# EAGLE design SparkFun_Si4707_Breakout (EAGLE 7.2.0)
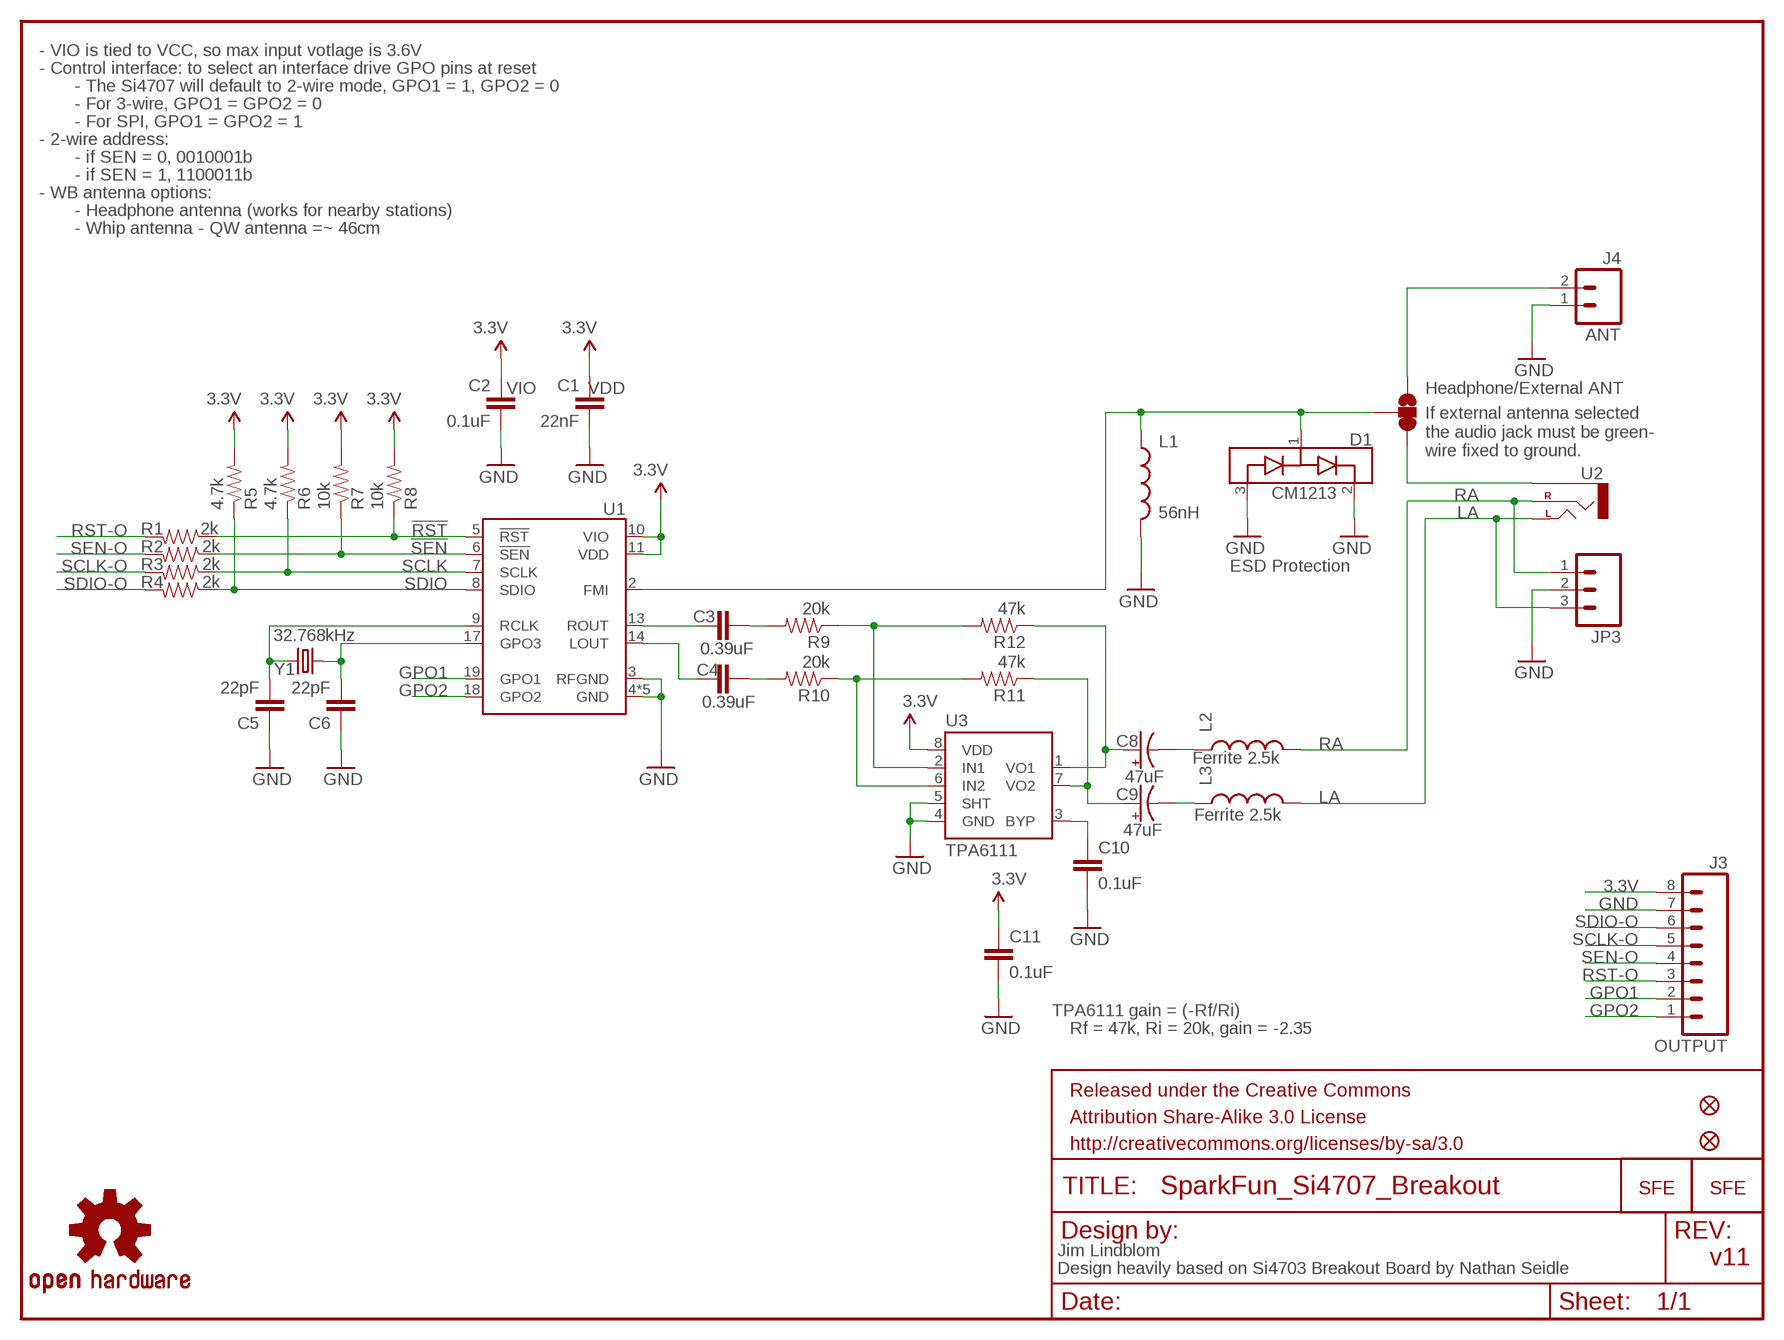
[diagram p0: schematic, sheet 1]

## Parts
C1  22nF  CAP0402-CAP  [0402-CAP]
C2  0.1uF  CAP0402-CAP  [0402-CAP]
C3  0.39uF  CAP0402-CAP  [0402-CAP]
C4  0.39uF  CAP0402-CAP  [0402-CAP]
C5  22pF  CAP0402-CAP  [0402-CAP]
C6  22pF  CAP0402-CAP  [0402-CAP]
C8  47uF  CAP_POL3528  [EIA3528]
C9  47uF  CAP_POL3528  [EIA3528]
C10  0.1uF  CAP0402-CAP  [0402-CAP]
C11  0.1uF  CAP0402-CAP  [0402-CAP]
D1  CM1213  [SOT23-3]
FRAME1  FRAME-LETTER  [CREATIVE_COMMONS]
J3  OUTPUT  M081X08  [1X08]
J4  ANT  M02PTH  [1X02]
JP1  LOGO-SFENEW  [SFE-NEW-WEBLOGO]
JP2  LOGO-SFESK  [SFE-LOGO-FLAME]
JP3  M03PTH  [1X03]
JP4  FIDUCIALUFIDUCIAL  [MICRO-FIDUCIAL]
JP5  FIDUCIALUFIDUCIAL  [MICRO-FIDUCIAL]
L1  56nH  INDUCTOR0603  [0603]
L2  Ferrite 2.5k  INDUCTOR0402  [C0402]
L3  Ferrite 2.5k  INDUCTOR0402  [C0402]
R1  2k  RESISTOR0402-RES  [0402-RES]
R2  2k  RESISTOR0402-RES  [0402-RES]
R3  2k  RESISTOR0402-RES  [0402-RES]
R4  2k  RESISTOR0402-RES  [0402-RES]
R5  4.7k  RESISTOR0402-RES  [0402-RES]
R6  4.7k  RESISTOR0402-RES  [0402-RES]
R7  10k  RESISTOR0402-RES  [0402-RES]
R8  10k  RESISTOR0402-RES  [0402-RES]
R9  20k  RESISTOR0402-RES  [0402-RES]
R10  20k  RESISTOR0402-RES  [0402-RES]
R11  47k  RESISTOR0402-RES  [0402-RES]
R12  47k  RESISTOR0402-RES  [0402-RES]
SJ2  SOLDERJUMPER_2WAYS  [SJ_3]
U1  SI4707  [SI470X]
U2  AUDIO-JACKSMD2  [AUDIO-JACK-3.5MM-SMD]
U3  TPA6111  SPARKFUN_TPA6111SMD  [SPARKFUN_SO08]
U$2  OSHW-LOGOS  [OSHW-LOGO-S]
Y1  32.768kHz  CRYSTAL32-SMD  [CRYSTAL-32KHZ-SMD]

## Nets
3.3V: C1.1 C2.1 C11.1 J3.8 R5.2 R6.2 R7.2 R8.2 U1.10(VIO) U1.11(VDD) U3.8(VDD)
!RST: R1.1 R8.1 U1.5(!RST)
!SEN: R2.1 R7.1 U1.6(!SEN)
GND: C1.2 C2.2 C5.1 C6.1 C10.2 C11.2 D1.2(VP) D1.3(VN) J3.7 J4.1 JP3.2 L1.2 U1.3(RFGND) U1.4(GND) U1.12(GND) U1.15(GND) U1.16(GND) U1.21(GND) U3.4(GND) U3.5(SHT)
GPO1: J3.2 U1.19(GPO1)
GPO2: J3.1 U1.18(GPO2)
J1: D1.1(CH1) L1.1 SJ2.2 U1.2(FMI)
LA: JP3.3 L3.2 U2.TIP(LEFT)
LOUT: C4.1 U1.14(LOUT)
N$3: C3.2 R9.2
N$4: C4.2 R10.2
N$6: C6.2 U1.17(GPO3) Y1.X1
N$7: SJ2.1 U2.SLEEVE
N$9: J4.2 SJ2.3
N$10: R9.1 R12.2 U3.2(IN1)
N$11: R10.1 R11.2 U3.6(IN2)
N$12: C10.1 U3.3(BYP)
N$13: C8.C(-) L2.1
N$14: C9.C(-) L3.1
N$15: C8.A(+) R12.1 U3.1(VO1)
N$16: C9.A(+) R11.1 U3.7(VO2)
RA: JP3.1 L2.2 U2.RING(RIGHT)
RCLK: C5.2 U1.9(RCLK) Y1.X2
ROUT: C3.1 U1.13(ROUT)
RST-O: J3.3 R1.2
SCLK: R3.1 R6.1 U1.7(SCLK)
SCLK-O: J3.5 R3.2
SDIO: R4.1 R5.1 U1.8(SDIO)
SDIO-O: J3.6 R4.2
SEN-O: J3.4 R2.2

## Notes on the sheet
- - VIO is tied to VCC, so max input votlage is 3.6V
- - Control interface: to select an interface drive GPO pins at reset
- - The Si4707 will default to 2-wire mode, GPO1 = 1, GPO2 = 0
- - For 3-wire, GPO1 = GPO2 = 0
- - For SPI, GPO1 = GPO2 = 1
- - 2-wire address:
- - if SEN = 0, 0010001b
- - if SEN = 1, 1100011b
- - WB antenna options:
- - Headphone antenna (works for nearby stations)
- - Whip antenna - QW antenna =~ 46cm
- VIO | VDD | Headphone/External ANT
- If external antenna selected
  the audio jack must be green-
  wire fixed to ground.
- ESD Protection
- TPA6111 gain = (-Rf/Ri)
- Rf = 47k, Ri = 20k, gain = -2.35
- Jim Lindblom
- v11
- Design heavily based on Si4703 Breakout Board by Nathan Seidle

## Library data of the parts
C1-C6 C10 C11 = SparkFun-Passives:CAP: Capacitor Standard 0603 ceramic capacitor, and 0.1" leaded capacitor.
C8 C9 = SparkFun-Passives:CAP_POL: Capacitor Polarized These are standard SMD and PTH capacitors. Normally 10uF, 47uF, and 100uF in electrolytic and tantalum varieties. Always verify the external diameter of the through hole cap, it varies with capacity, voltage, and manufacturer. The EIA devices should be standard.
D1 = SparkFun-DiscreteSemi:CM1213
FRAME1 = SparkFun-Aesthetics:FRAME-LETTER: Schematic Frame Standard 8.5x11 US Letter frame
J3 = SparkFun-Connectors:M08: Header 8 Standard 8-pin 0.1" header. Use with straight break away headers (SKU : PRT-00116), right angle break away headers (PRT-00553), swiss pins (PRT-00743), machine pins (PRT-00117), and female headers (PRT-00115).
J4 = SparkFun-Connectors:M02: Header 2 Standard 2-pin 0.1" header. Use with straight break away headers (SKU : PRT-00116), right angle break away headers (PRT-00553), swiss pins (PRT-00743), machine pins (PRT-00117), and female headers (PRT-00115). Molex polarized connector foot print use with SKU : PRT-08233 with associated crimp pins and housings.
JP1 JP2 = SparkFun:LOGO-SFE: Spark Fun Electronics PCB Logo This is the standard Spark Fun Electronics PCB logo.
JP3 = SparkFun-Connectors:M03: Header 3 Standard 3-pin 0.1" header. Use with straight break away headers (SKU : PRT-00116), right angle break away headers (PRT-00553), swiss pins (PRT-00743), machine pins (PRT-00117), and female headers (PRT-00115). Molex polarized connector foot print use with SKU : PRT-08232 with associated crimp pins and housings.
JP4 JP5 = SparkFun:FIDUCIAL: Fiducial Alignment Points Various fiducial points for machine vision alignment.
L1-L3 = SparkFun-Passives:INDUCTOR: Inductors Basic Inductor/Choke - 0603 and 1206. Footprints are not proven and vary greatly between part numbers.
R1-R12 = SparkFun-Passives:RESISTOR: Resistor Basic schematic elements and footprints for 0603, 1206, and PTH resistors.
SJ2 = SparkFun-Passives:SOLDERJUMPER_2WAY: Solder Jumper 2 way solder jumper
U1 = SparkFun-RF:SI4707: Silicon Labs Si4707 Weather Band and SAME Data Receiver Weather Band support - 162.4-162.55MHz SAME Processor 1050 Hz alert tone WB digital tuning Package: QFN-20 (SI470X.PAC), 3x3x0.55mm, 20 pin Supply Voltage: 2.7 to 5.5V VDD 1.5 to 3.6V VIO Supply current: 19.1 to 23mA
U2 = SparkFun-Connectors:AUDIO-JACK: 3.5mm Audio Jack Simple 3.5mm common PCB mount audio jack. SKU: PRT-08032
U3 = SparkFun-DigitalIC:SPARKFUN_TPA6111
U$2 = SparkFun-Aesthetics:OSHW-LOGO: Open Source Hardware Logo This logo indicates the piece of hardware it is found on incorporates a OSHW license and/or adheres to the definition of open source hardware found here: http://freedomdefined.org/OSHW
Y1 = SparkFun-FreqCtrl:CRYSTAL: Various standard crystals. Proven footprints. Spark Fun Electronics SKU : COM-00534

## Board
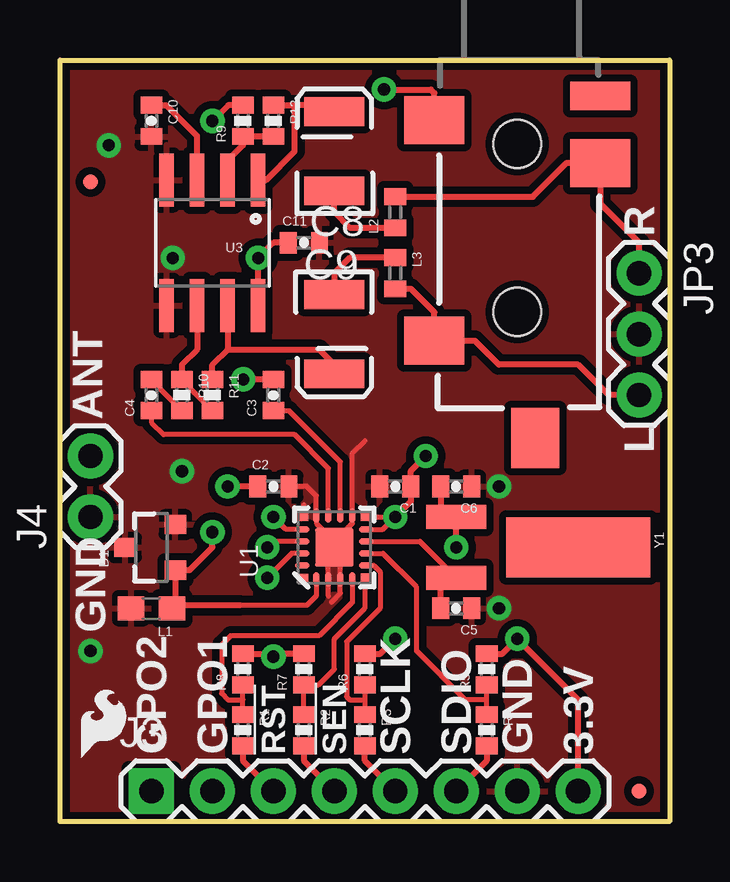
[diagram p1: board, top side]
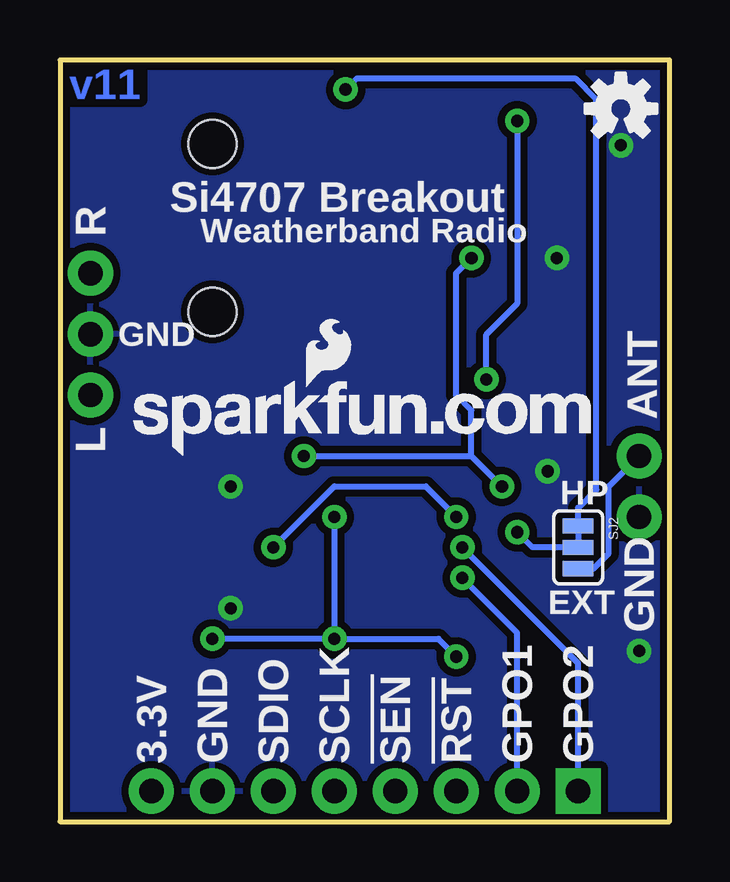
[diagram p2: board, bottom side, seen from below]

Size 25.4 x 31.75 mm. Coordinates in mm from the lower left corner, seen from the top.
Outline: 0,0 0,31.75 25.4,31.75 25.4,0 0,0
Copper layers (1*16): Top 0.035mm / dielectric 1.5mm / Bottom 0.035mm
Design rules "default": minimum track width 8mil, minimum drill 20mil, track to track 8mil, track to pad 8mil, pad to pad 8mil, via to via 8mil, smd to smd 8mil, copper to edge 8mil, drill to drill 8mil, minimum pad ring 12mil, minimum via ring 10mil, stop-mask expansion 4mil, vias tented up to drill 20mil, thermal gap 10mil

### Footprints (pad centres in the part's own frame; a part is rotated, then mirrored left to right if it is on the bottom)
0402-CAP = smd 0.7 x 0.9: 1 -0.65,0; 2 0.65,0
EIA3528 = smd 1.2 x 2.5: A 1.65,0; C -1.65,0
SOT23-3 = smd 0.8 x 0.9: 1 -0.95,-1; 2 0.95,-1; 3 0,1.1
1X08 = drill 1.016 pad 1.88 square: 1 0,0 | drill 1.016 pad 1.88: 2 2.54,0; 3 5.08,0; 4 7.62,0; 5 10.16,0; 6 12.7,0; 7 15.24,0; 8 17.78,0
1X02 = drill 1.016 pad 1.88: 1 0,0; 2 2.54,0
1X03 = drill 1.016 pad 1.88: 1 0,0; 2 2.54,0; 3 5.08,0
MICRO-FIDUCIAL = smd 0.635 x 0.635: 1 0,0
0603 = smd 1.1 x 1: 1 -0.85,0; 2 0.85,0
C0402 = smd 0.7 x 0.9: 1 -0.65,0; 2 0.65,0
0402-RES = smd 0.7 x 0.9: 1 -0.65,0; 2 0.65,0
SJ_3 = smd 0.635 x 1.27: 1 -0.889,0; 2 0,0; 3 0.889,0
SI470X = smd 0.34 x 0.34: 1 -1.275,1.265; 6 -1.265,-1.265; 11 1.265,-1.265; 16 1.265,1.265 | smd 0.61 x 0.28: 2 -1.335,0.75; 3 -1.335,0.25; 4 -1.335,-0.25; 5 -1.335,-0.75; 12 1.335,-0.75; 13 1.335,-0.25; 14 1.335,0.25; 15 1.335,0.75 | smd 0.28 x 0.61: 7 -0.75,-1.335; 8 -0.25,-1.335; 9 0.25,-1.335; 10 0.75,-1.335; 17 0.75,1.335; 18 0.25,1.335; 19 -0.25,1.335; 20 -0.75,1.335 | smd 1.6 x 1.6: 21 0,0
AUDIO-JACK-3.5MM-SMD = smd 2 x 2.5: RING 4.3,3.45; SLEEVE 2.5,-3.45; TIP 11.7,-3.45 | smd 1.2 x 2.5: RSH 1.5,3.45 | smd 2.5 x 2: TSH 15.75,0.75 | hole 2: 3.5,0; 10.5,0
SPARKFUN_SO08 = smd 0.61 x 2.21: 1 -1.905,-2.616; 2 -0.635,-2.616; 3 0.635,-2.616; 4 1.905,-2.616; 5 1.905,2.616; 6 0.635,2.616; 7 -0.635,2.616; 8 -1.905,2.616
CRYSTAL-32KHZ-SMD = smd 2.5 x 6: SHEILD 0,5.08 | smd 1 x 2.5: X1 -1.27,0; X2 1.27,0

### Placement (x,y rotation side)
C1  13.97,13.97 180 top
C2  8.89,13.97 0 top
C3  8.89,17.78 90 top
C4  3.81,17.78 90 top
C5  16.51,8.89 180 top
C6  16.51,13.97 180 top
C8  11.43,27.94 90 top
C9  11.43,20.32 270 top
C10  3.81,29.21 270 top
C11  10.16,24.13 0 top
D1  3.81,11.43 90 top
FRAME1  -90.03,1.27 0 top  (outside the outline)
J3  3.81,1.27 0 top
J4  1.27,12.7 90 top
JP1  22.35,15.24 0 bottom
JP2  0.89,2.67 0 top
JP3  24.13,22.86 270 top
JP4  24.13,1.27 0 top
JP5  1.27,26.67 0 top
L1  3.81,8.89 180 top
L2  13.97,25.4 90 top
L3  13.97,22.86 270 top
R1  7.62,3.81 270 top
R2  10.16,3.81 270 top
R3  12.7,3.81 270 top
R4  17.78,3.81 270 top
R5  17.78,6.35 90 top
R6  12.7,6.35 90 top
R7  10.16,6.35 90 top
R8  7.62,6.35 90 top
R9  7.62,29.21 90 top
R10  5.08,17.78 270 top
R11  6.35,17.78 270 top
R12  8.89,29.21 270 top
SJ2  3.81,11.43 270 bottom
U1  11.43,11.43 90 top
U2  19.05,31.75 270 top
U3  6.35,24.13 180 top
U$2  2.03,29.72 0 bottom
Y1  16.51,11.43 270 top

### Tracks (layer width: path | path; a pad name or v marks a point on that pad's centre or on a via)
3.3V  (via drill 0.51)
  Top 0.203: U1.11 v13.96,12.7 v13.97,12.7 13.45,12.18 U1.10
  Top 0.254: U3.8 v8.26,23.5 8.89,24.13 C11.1 | C2.1 v6.99,13.97 | v13.97,12.7 14.62,13.35 C1.1 14.62,14.62 v15.24,15.24 | R8.2 8.76,7 v8.89,6.87 9.02,7 R7.2 | R6.2 13.35,7 v13.97,7.62 | J3.8 21.59,5.08 v19.05,7.62 18.43,7 R5.2
  Bottom 0.254: v13.97,12.7 v13.97,7.62 | 8.26,15.24 v6.99,13.97 | 8.26,15.24 8.26,17.14 8.89,17.78 8.89,22.86 v8.26,23.5 | v15.24,15.24 8.26,15.24 | v13.97,7.62 v19.05,7.62 | v13.97,7.62 9.64,7.62 v8.89,6.87
!RST
  Top 0.203: R1.1 7.62,5.08 | 7.62,5.08 R8.1 | U1.5 12.18,9.13 10.79,7.75 7.11,7.75 6.73,7.37 6.73,5.33 6.99,5.08 7.62,5.08
!SEN
  Top 0.203: R2.1 R7.1 10.78,5.7 11.43,6.35 11.43,7.62 12.7,8.88 U1.6
GND  (via drill 0.51)
  Top 0.203: 11.43,11.68 10.68,12.43 U1.15 10.68,13.58 10.29,13.97 9.53,13.97 | 11.43,11.68 12.18,12.43 U1.12 12.18,15.36 12.7,15.88 | 11.43,11.68 U1.21 | 11.3,9.14 11.68,9.52 U1.4 | U1.16 10.16,13.2 10.16,13.21 | 11.18,11.43 U1.21 | U1.21 11.18,11.18 U1.3 11.18,10.04 11.18,10.03 11.18,9.4 | U1.4 11.68,11.18 U1.21 | U1.4 11.68,10.16
  other vias: 18.29,8.89 18.29,13.97 5.08,14.61 2.03,28.19 4.7,23.5 1.27,7.11
  pour Top (isolate 0.305): 0,31.75 0,0 25.4,0 25.4,31.75
  pour Bottom (isolate 0.305): 0,31.75 0,0 25.4,0 25.4,31.75
GPO1  (via drill 0.51)
  Top 0.203: U1.19 9.66,11.18 v8.64,10.16
  Bottom 0.254: J3.2 6.35,7.87 v8.64,10.16
GPO2  (via drill 0.51)
  Top 0.203: U1.18 8.89,11.68 v8.64,11.43
  Bottom 0.254: v8.64,11.43 3.81,6.6 J3.1
J1  (via drill 0.51)
  Top 0.203: U1.2 10.68,9.41 10.29,9.02 7.49,9.02
  Top 0.254: 7.49,9.02 4.79,9.02 L1.1 4.81,9.04 D1.1 5.4,10.48 6.35,11.43 v6.35,12.06
  Bottom 0.254: SJ2.2 5.71,11.43 v6.35,12.06
LA
  Top 0.254: L3.2 14.62,22.21 15.6,21.23 U2.TIP 17.29,20.05 18.29,19.05 21.59,19.05 22.86,17.78 JP3.3
LOUT
  Top 0.203: U1.14 11.18,14.73 9.78,16.13 4.32,16.13 3.81,16.64 C4.1
N$1
  Bottom 0.254: 3.81,12.57 3.81,11.3
N$3  (via drill 0.51)
  Top 0.254: C3.2 v7.63,18.43 | R9.2 7,29.86 v6.35,29.21
  Bottom 0.254: v7.63,18.43 7.63,20.3 6.35,21.59 v6.35,29.21
N$4
  Top 0.203: R10.2 5.08,17.14 3.81,18.41 C4.2
N$6  (via drill 0.51)
  Top 0.203: U1.17 9.41,12.18 v8.89,12.7
  Top 0.254: v16.51,11.43 Y1.X1 16.13,12.7 15.86,12.97 C6.2
  Bottom 0.254: v16.51,11.43 13.97,13.97 10.16,13.97 v8.89,12.7
N$7  (via drill 0.51)
  Top 0.254: U2.SLEEVE 15.6,30.37 15.45,30.52 v13.5,30.52
  Bottom 0.254: SJ2.1 3.81,13.08 3.05,13.84 3.05,30.1 3.94,30.99 13.03,30.99 v13.5,30.52
N$9
  Bottom 0.254: J4.2 2.54,13.97 2.54,11.18 3.17,10.54 SJ2.3
N$10
  Top 0.254: U3.2 6.97,27.54 7.62,28.19 R9.1 R12.2
N$11
  Top 0.203: R11.2 6.35,17.14 5.08,18.41
  Top 0.254: U3.6 5.71,19.68 5.08,19.05 R10.1 5.08,18.41
N$12
  Top 0.254: C10.1 4.43,29.86 5.71,28.57 U3.3
N$13
  Top 0.254: L2.1 12.08,24.75 11.43,25.4 C8.C
N$14
  Top 0.254: L3.1 12.08,23.51 11.43,22.86 C9.C
N$15
  Top 0.254: U3.1 8.59,26.75 9.78,27.94 9.78,29.86 | C8.A 11.16,29.86 9.78,29.86 | R12.1 9.78,29.86
N$16
  Top 0.254: R11.1 6.35,19.05 6.99,19.68 | U3.7 6.99,19.68 | 6.99,19.68 10.79,19.68 11.43,19.05 C9.A
RA
  Top 0.254: U2.RING 22.37,27.45 | L2.2 19.7,26.05 21.1,27.45 U2.RING | U2.RING 22.5,25.76 24.13,24.13 JP3.1
RCLK
  Top 0.203: 15.85,10.16 15.86,10.14 16.5,10.14 Y1.X2 14.99,11.68 U1.9
  Top 0.254: C5.2 15.86,10.14
ROUT
  Top 0.203: U1.13 11.68,14.99 9.54,17.13 C3.1
RST-O
  Top 0.254: R1.2 7.62,2.54 J3.3
SCLK
  Top 0.203: U1.7 13.07,10.68 13.34,10.41 13.34,8.89 11.94,7.49 11.94,5.21 12.06,5.08 12.7,5.08 | R6.1 12.7,5.08 | 12.7,5.08 R3.1
SCLK-O
  Top 0.254: J3.5 12.7,2.54 R3.2
SDIO
  Top 0.203: U1.8 13.46,11.18 14.86,9.78 14.86,7.11 16.89,5.08 17.78,5.08 | R4.1 17.78,5.08 | 17.78,5.08 R5.1
SDIO-O
  Top 0.254: R4.2 17.78,2.54 J3.6
SEN-O
  Top 0.254: R2.2 10.16,2.54 J3.4

### Text on the board
Bottom: v11
tPlace: R | ANT | L | GND | GPO2 | GPO1 | !RST | !SEN | SCLK | SDIO | GND | 3.3V
bPlace: Si4707 Breakout | Weatherband Radio | R | GND | ANT | L | HP | GND | EXT | GPO2 | GPO1 | !RST | !SEN | SCLK | SDIO | GND | 3.3V